# EAGLE design WIMOS-Accelerometro (EAGLE 7.7.0)
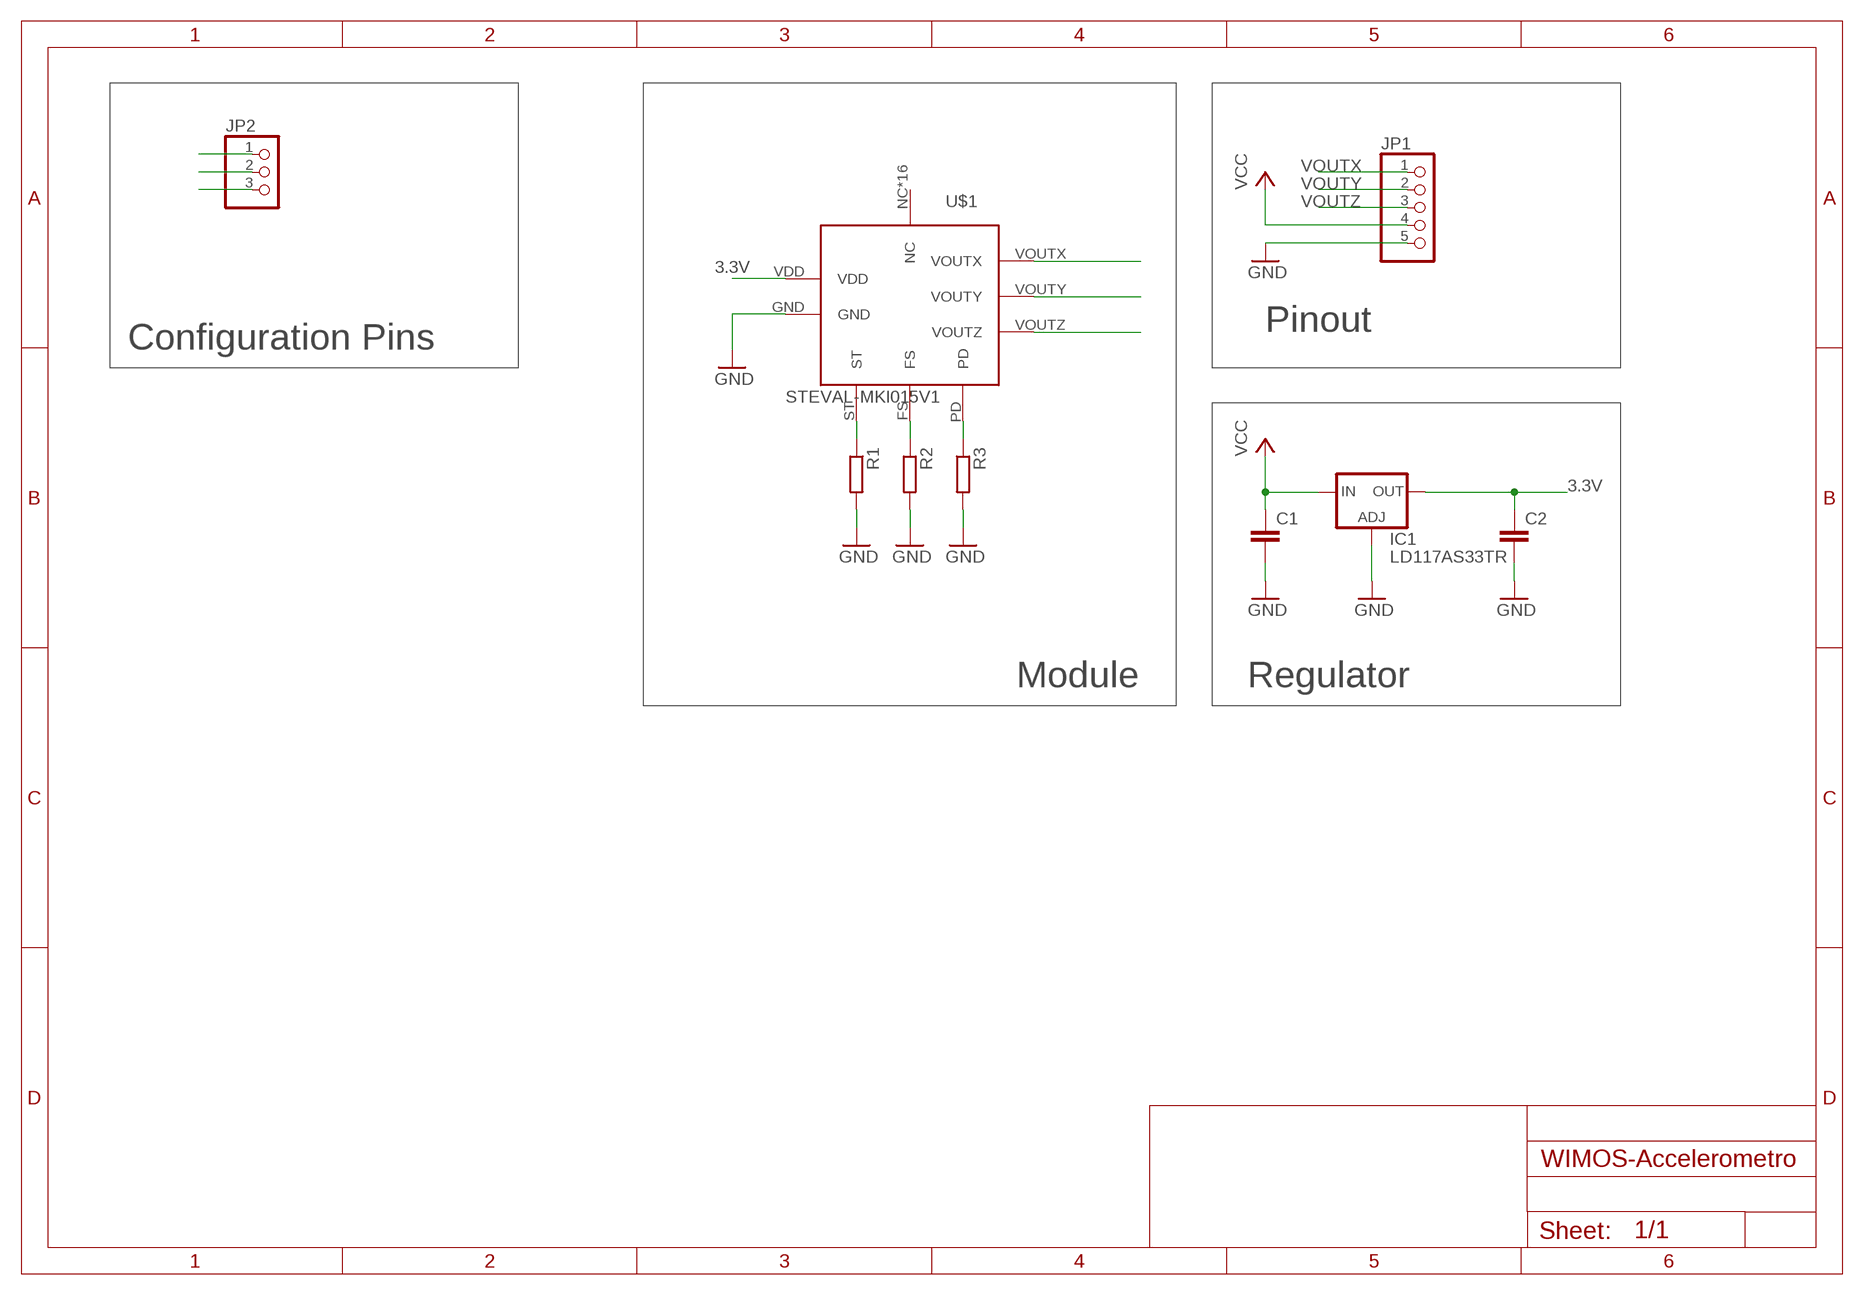
[diagram p0: schematic, sheet 1]

## Parts
C1  C-EUC0805  [C0805]
C2  C-EUC0805  [C0805]
IC1  LD117AS33TR  [SOT223]
JP1  PINHD-1X5  [1X05]
JP2  PINHD-1X3  [1X03]
R1  R-EU_R0805  [R0805]
R2  R-EU_R0805  [R0805]
R3  R-EU_R0805  [R0805]
U$1  STEVAL-MKI015V1  [STEVAL-MKI015V1]

## Nets
3.3V: C2.1 IC1.4(OUT) U$1.VDD
FS: JP2.2 R2.1 U$1.FS
GND: C1.2 C2.2 IC1.1(ADJ) JP1.5 R1.2 R2.2 R3.2 U$1.GND
PD: JP2.3 R3.1 U$1.PD
ST: JP2.1 R1.1 U$1.ST
VCC: C1.1 IC1.3(IN) JP1.4
VOUTX: JP1.1 U$1.VOUTX
VOUTY: JP1.2 U$1.VOUTY
VOUTZ: JP1.3 U$1.VOUTZ
Unconnected: U$1.NC U$1.NC2(NC) U$1.NC3(NC) U$1.NC4(NC) U$1.NC5(NC) U$1.NC6(NC) U$1.NC7(NC) U$1.NC8(NC) U$1.NC9(NC) U$1.NC10(NC) U$1.NC11(NC) U$1.NC12(NC) U$1.NC13(NC) U$1.NC14(NC) U$1.NC15(NC) U$1.NC16(NC)

## Notes on the sheet
- Pinout
- Configuration Pins
- Module | Regulator

## Library data of the parts
C1 C2 = rcl:C-EU: CAPACITOR, European symbol
IC1 = v-reg:LD117A?*: Low drop fixed and adjustable positive voltage regulators 1 A Source: http://www.st.com/stonline/products/literature/ds/7194/ld1117axx.pdf
JP1 = pinhead:PINHD-1X5: PIN HEADER
JP2 = pinhead:PINHD-1X3: PIN HEADER
R1-R3 = resistor:R-EU_: RESISTOR, European symbol
U$1 = STEVAL-MKI015V1:STEVAL-MKI015V1

## Module INPUT
Ports: 

### Library data of the parts

## Net classes
0 default: width 0.203 mm
2 gnd: width 0.203 mm, drill 0.406 mm, clearance 0.203 mm
3 usbvcc: width 0.203 mm, drill 0.406 mm, clearance 0.203 mm
4 USBpair: width 0.254 mm, drill 0.406 mm, clearance 0.61 mm

## Board
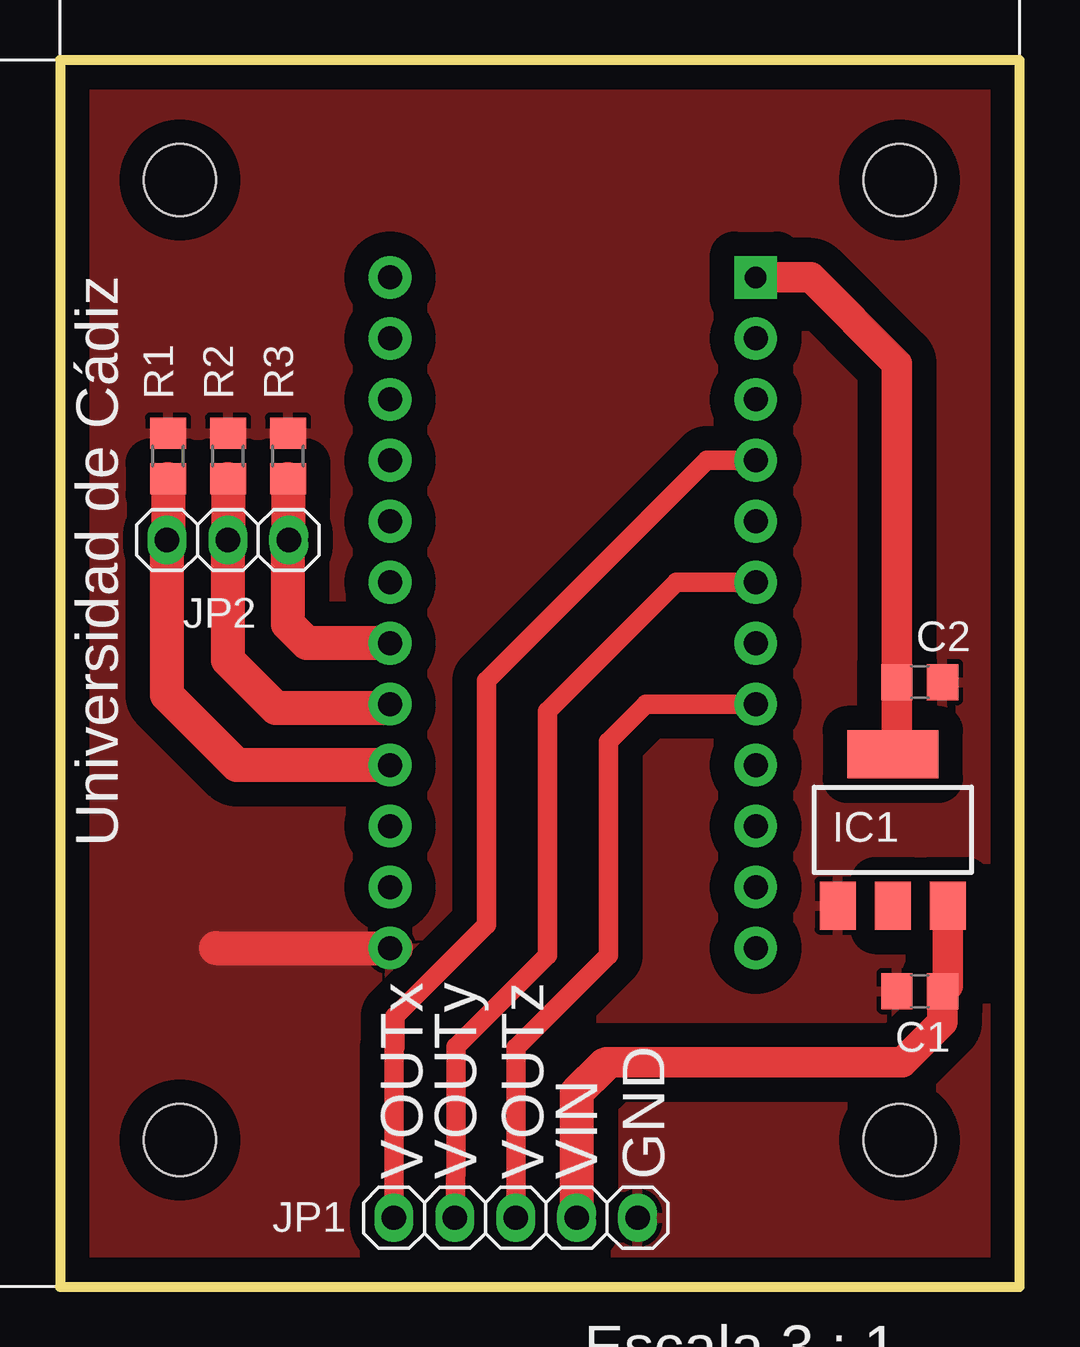
[diagram p1: board, top side]
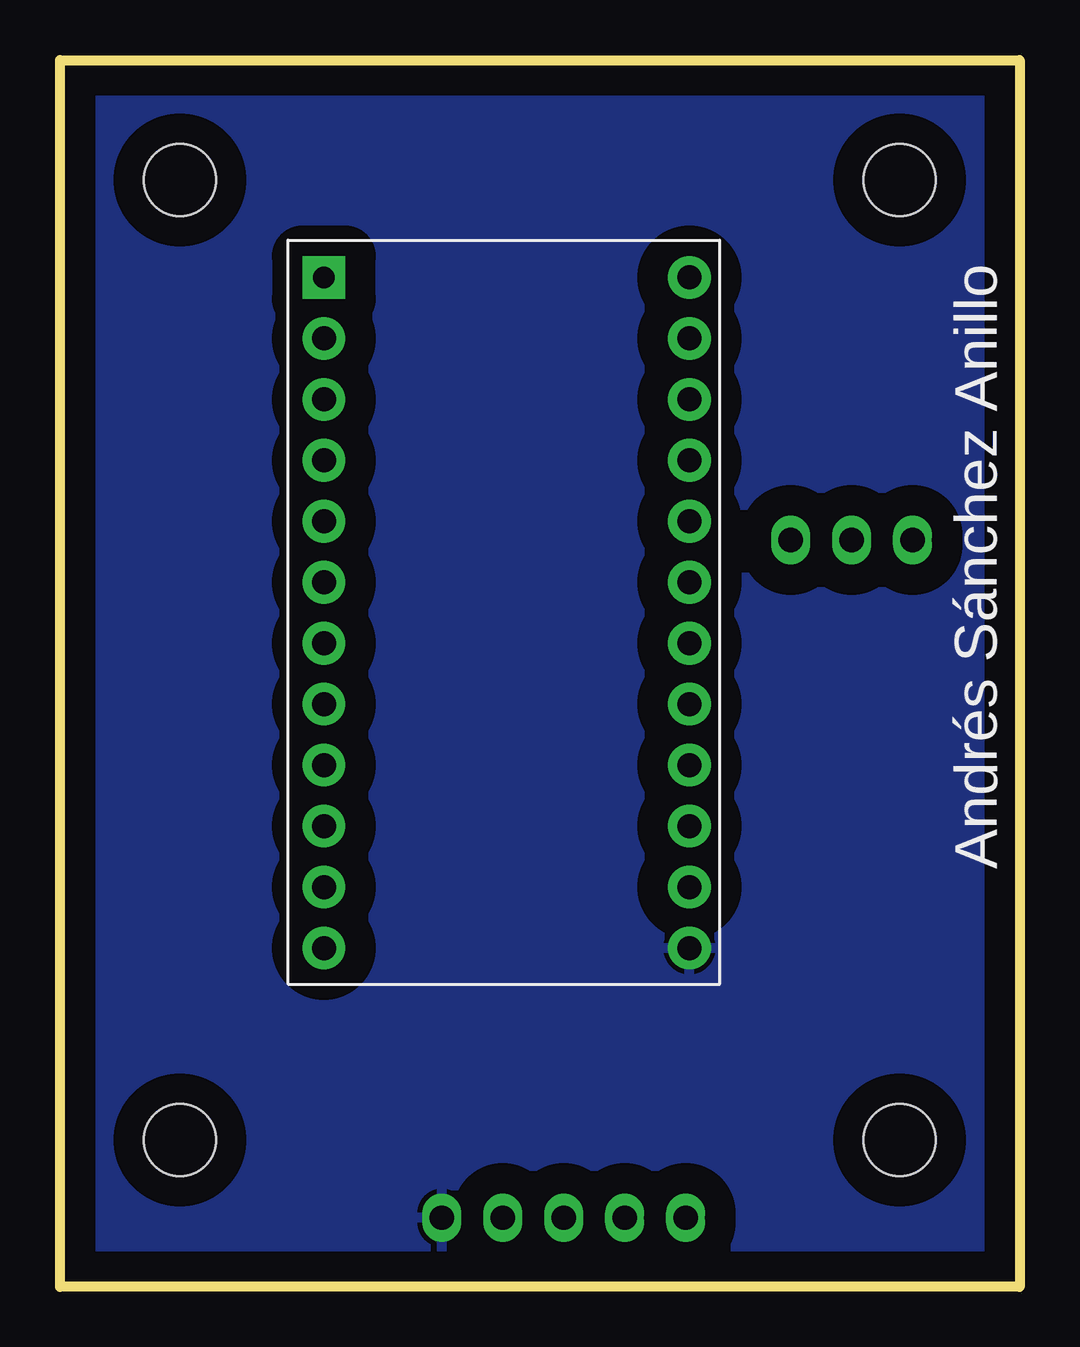
[diagram p2: board, bottom side, seen from below]

Size 40 x 51.12 mm. Coordinates in mm from the lower left corner, seen from the top.
Outline: 0,51.12 0,0 40,0 40,51.12 0,51.12
Copper layers (1*16): Top 0.035mm / dielectric 1.6mm / Bottom 0.035mm
Design rules "default *": minimum track width 8mil, minimum drill 16mil, track to track 8mil, track to pad 8mil, pad to pad 8mil, via to via 8mil, smd to smd 6mil, copper to edge 20mil, drill to drill 12mil, minimum pad ring 12mil, minimum via ring 8mil, stop-mask expansion 2mil, vias tented up to drill 25mil, thermal gap 8mil
Holes 3 mm at 5,6.12 35,6.12 35,46.12 5,46.12

### Footprints (pad centres in the part's own frame; a part is rotated, then mirrored left to right if it is on the bottom)
C0805 = smd 1.3 x 1.5: 1 -0.95,0; 2 0.95,0
SOT223 = smd 1.5 x 2: 1 -2.3,-3.15; 2 0,-3.15; 3 2.3,-3.15 | smd 3.8 x 2: 4 0,3.15
1X05 = drill 1.016 long: 1 -5.08,0; 2 -2.54,0; 3 0,0; 4 2.54,0; 5 5.08,0
1X03 = drill 1.016 long: 1 -2.54,0; 2 0,0; 3 2.54,0
R0805 = smd 1.3 x 1.5: 1 -0.95,0; 2 0.95,0
STEVAL-MKI015V1 = drill 1 pad 1.778: FS 16.74,11.66; GND 16.74,1.5; NC 1.5,26.9; NC2 1.5,24.36; NC3 1.5,19.28; NC4 1.5,14.2; NC5 1.5,9.12; NC6 1.5,6.58; NC7 1.5,4.04; NC8 1.5,1.5; NC9 16.74,4.04; NC10 16.74,6.58; NC11 16.74,16.74; NC12 16.74,19.28; NC13 16.74,21.82; NC14 16.74,24.36; NC15 16.74,26.9; NC16 16.74,29.44; PD 16.74,14.2; ST 16.74,9.12; VOUTX 1.5,21.82; VOUTY 1.5,16.74; VOUTZ 1.5,11.66 | drill 0.9 pad 1.778 square: VDD 1.5,29.44

### Placement (x,y rotation side)
C1  35.84,12.32 180 top
C2  35.84,25.2 0 top
IC1  34.72,19.04 0 top
JP1  19,2.88 0 top
JP2  7,31.12 0 top
R1  4.5,34.62 90 top
R2  7,34.62 90 top
R3  9.5,34.62 90 top
U$1  30.5,12.62 0 bottom

### Tracks (layer width: path | path; a pad name or v marks a point on that pad's centre or on a via)
3.3V
  Top 1.016: U$1.VDD 29.06,42
  Top 1.27: IC1.4 34.89,22.36 C2.1 34.89,38.47 31.3,42.06 U$1.VDD
FS
  Top 1.422: R2.1 JP2.2 7,26.12 9,24.12 13.6,24.12 U$1.FS
GND
  Top 1.422: 6.5,14.12 14,14.12
  pour Top (isolate 1.016): -4,59.12 -4,-3.88 41,-3.88 41,59.12
  pour Bottom (isolate 1.27): -4,59.12 -4,-3.88 41,-3.88 41,59.12
PD
  Top 1.422: R3.1 9.5,31.16 JP2.3 9.5,31.08 9.5,27.62 10.3,26.82 U$1.PD
ST
  Top 1.422: R1.1 4.5,31.16 JP2.1 4.46,24.66 7.38,21.74 U$1.ST
VCC
  Top 1.27: 22.68,9.24 22.79,9.35 35.11,9.35 36.79,11.03 C1.1 37.02,12.55 IC1.3
  Top 1.422: 22.68,9.24 21.54,8.1 JP1.4
VOUTX
  Top 0.813: JP1.1 13.92,9.96 13.97,10.01 13.97,11.28 17.78,15.09 17.78,25.25 26.97,34.44 U$1.VOUTX
VOUTY
  Top 0.813: JP1.2 16.51,5.17 16.51,10.01 20.32,13.82 20.32,23.98 25.7,29.36 U$1.VOUTY
VOUTZ
  Top 0.813: JP1.3 19,9.96 22.86,13.82 22.86,22.71 24.43,24.28 U$1.VOUTZ

### Text on the board
tPlace: Universidad de Cádiz | Escala 3 : 1
bPlace: Andrés Sánchez Anillo
tNames: VOUTx | VOUTy | VOUTz | VIN | GND